# Altium schematic sheet rs485.SchDoc
size A4
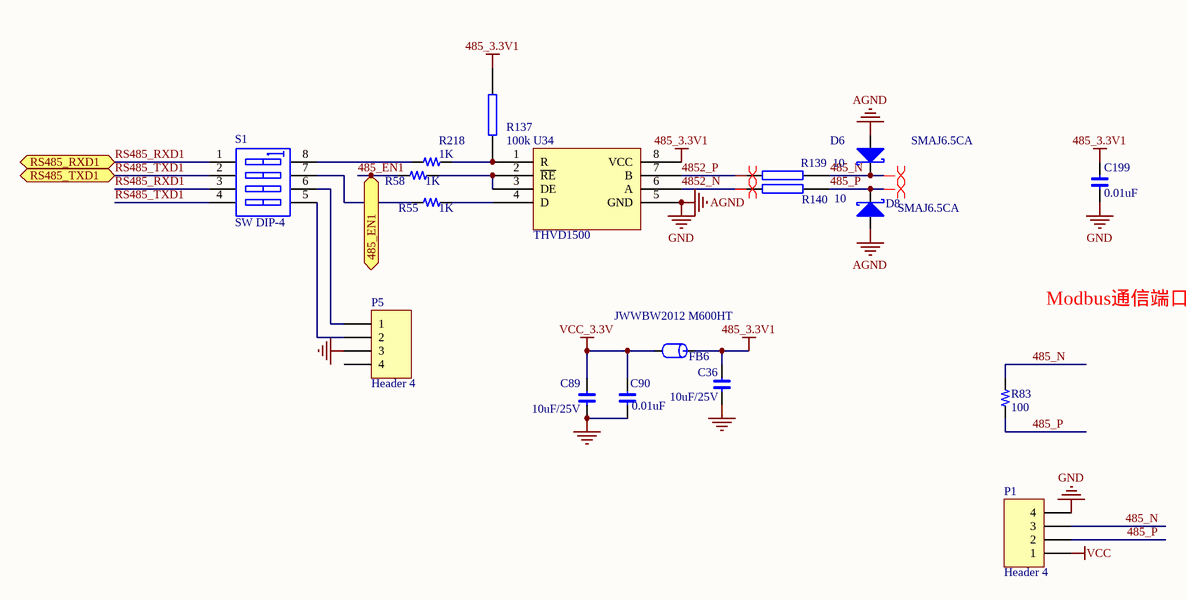
[diagram p0: rs485.SchDoc]

## Parts
C36  10uF/25V  [0603C]
C89  10uF/25V  [0603C]
C90  0.01uF  [0603C]
C199  0.01uF  [0603C]
D6  SMAJ6.5CA  [SMA]
D8  SMAJ6.5CA  [SMA]
FB6  JWWBW2012 M600HT  [0805CZ]
P1  Header 4  [4X2.54MMZ]
P5  Header 4  [4X2.54MMZ]
R55  1K  [0603R]
R58  1K  [0603R]
R83  100  [0603R]
R137  100k  [0603R]
R139  10  [1206R]
R140  10  [1206R]
R218  1K  [0603R]
S1  SW DIP-4  [SW_SMT_8]
U34  THVD1500  [so-8]

## Ports
485_EN1, RS485_RXD1, RS485_TXD1

## Nets
485_3.3V1: C36.2 C199.2 FB6.1 R137.2 U34.8(VCC)
AGND: C36.1 C89.1 C90.1 C199.1 D6.1(A) D8.1(A) P1.4 P5.3 U34.5(GND)  [also labelled GND]
VCC: P1.1
VCC_3.3V: C89.2 C90.2 FB6.2
485_EN1: R58.2 ; port 485_EN1
485_N: D6.2(K) P1.3 R83.2 R139.1
485_P: D8.2(K) P1.2 R83.1 R140.1
4852_N: R140.2 U34.6(A)
4852_P: R139.2 U34.7(B)
RS485_RXD1: S1.1(A1) S1.3(A3) ; port RS485_RXD1
RS485_TXD1: S1.2(A2) S1.4(A4) ; port RS485_TXD1
NetP5_1: P5.1 S1.6(B3)
NetP5_2: P5.2 S1.5(B4)
NetR55_1: R55.1 U34.4(D)
NetR55_2: R55.2 S1.7(B2)
NetR58_1: R58.1 U34.2(~{RE}) U34.3(DE)
NetR137_1: R137.1 R218.1 U34.1(R)
NetR218_2: R218.2 S1.8(B1)

Not connected (* = marked no-connect by the designer): P5 4

## Layout directives
differential pair: 485_N, 485_P, 4852_N, 4852_P

## Notes on the sheet
- Modbus通信端口

## Library data of the parts
C36 C89 C90 C199 = C
D6 D8 = DIODE S: Schottky Diode
FB6 = FB: Part Field 1: 磁珠/0603/1K ohm/100MHz; FB: BLM18BD102SN1(muRata); Text Field1: FB
P1 P5 = Header 4: Header, 4-Pin; LatestRevisionDate: 17-Jul-2002; LatestRevisionNote: Re-released for DXP Platform.; Publisher: Altium Limited
R55 R58 R83 R218 = R
R137 R139 R140 = RES2
S1 = SW DIP-4: DIP Switch, 4 Position, SPST; Published: 24-Mar-1999; LatestRevisionDate: 29-May-2009; LatestRevisionNote: IPC-7351 Footprint Added.; PackageVersion: Dec-2002; PackageReference: SO8; Publisher: Altium Limited; PackageDescription: 8-Pin Small Outline Integrated Circuit 1.27 mm Pitch; Code_JEDEC: MS-012-AA; Code_IPC: SOIC127P600-8
U34 = SN65HVD06D